# EAGLE schematic Cougar-eu_scheme_v36 (EAGLE 9.7.0)
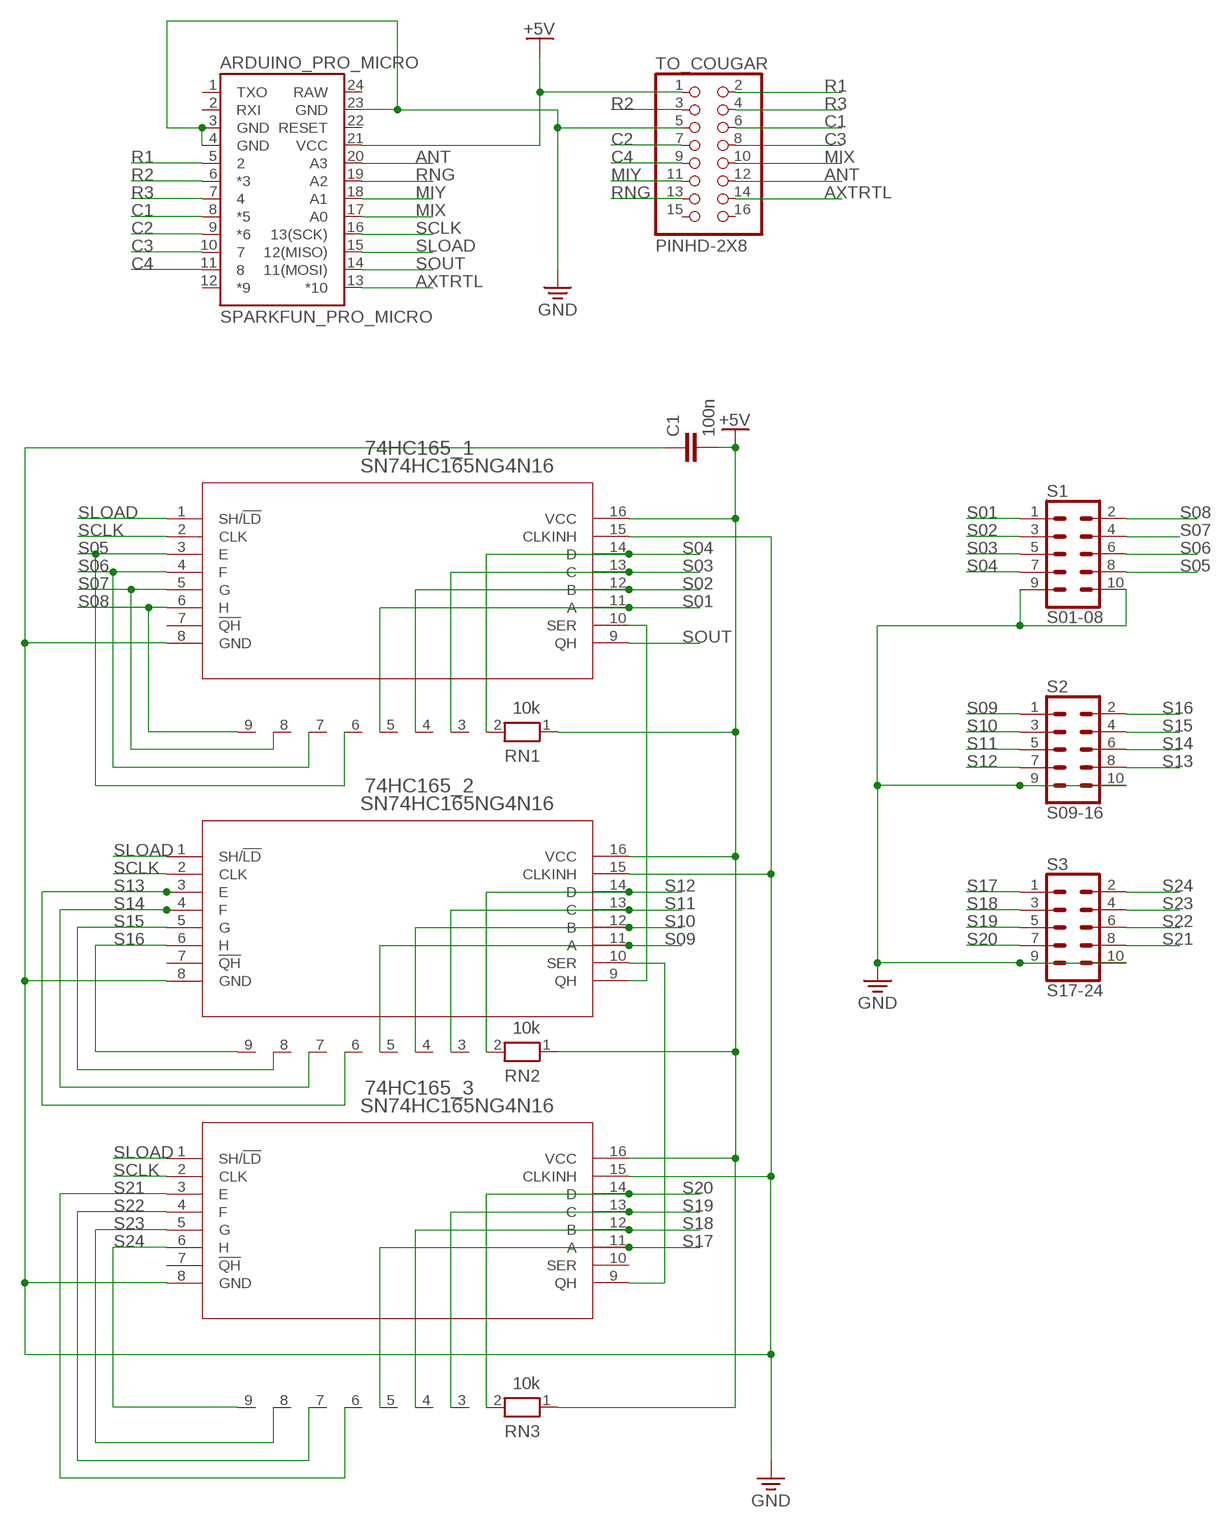
[diagram p0: schematic, sheet 1]

## Parts
74HC165_1  SN74HC165NG4N16  [N16]
74HC165_2  SN74HC165NG4N16  [N16]
74HC165_3  SN74HC165NG4N16  [N16]
ARDUINO_PRO_MICRO  SPARKFUN_PRO_MICRO  [SPARKFUN_PRO_MICRO]
C1  100n  C2,5-3  [C2.5-3]
RN1  10k  RN08  [RN-9]
RN2  10k  RN08  [RN-9]
RN3  10k  RN08  [RN-9]
S1  S01-08  CONN_05X2PTH  [2X5]
S2  S09-16  CONN_05X2PTH  [2X5]
S3  S17-24  CONN_05X2PTH  [2X5]
TO_COUGAR  PINHD-2X8  [2X08]

## Nets
+5V [Power]: 74HC165_1.16(VCC) 74HC165_2.16(VCC) 74HC165_3.16(VCC) ARDUINO_PRO_MICRO.21(VCC) C1.2 RN1.1 RN2.1 RN3.1 TO_COUGAR.1
ANT: ARDUINO_PRO_MICRO.20(A3) TO_COUGAR.12
AXTRTL: ARDUINO_PRO_MICRO.13(*10) TO_COUGAR.14
C1: ARDUINO_PRO_MICRO.8(*5) TO_COUGAR.6
C2: ARDUINO_PRO_MICRO.9(*6) TO_COUGAR.7
C3: ARDUINO_PRO_MICRO.10 TO_COUGAR.8
C4: ARDUINO_PRO_MICRO.11 TO_COUGAR.9
GND: 74HC165_1.8(GND) 74HC165_1.15(CLKINH) 74HC165_2.8(GND) 74HC165_2.15(CLKINH) 74HC165_3.8(GND) 74HC165_3.15(CLKINH) ARDUINO_PRO_MICRO.3(GND) ARDUINO_PRO_MICRO.4(GND) ARDUINO_PRO_MICRO.23(GND) C1.1 S1.9 S1.10 S2.9 S2.10 S3.9 S3.10 TO_COUGAR.5
MIX: ARDUINO_PRO_MICRO.17(A0) TO_COUGAR.10
MIY: ARDUINO_PRO_MICRO.18(A1) TO_COUGAR.11
N$1: 74HC165_1.10(SER) 74HC165_2.9(QH)
N$2: 74HC165_2.10(SER) 74HC165_3.9(QH)
R1: ARDUINO_PRO_MICRO.5 TO_COUGAR.2
R2: ARDUINO_PRO_MICRO.6(*3) TO_COUGAR.3
R3: ARDUINO_PRO_MICRO.7 TO_COUGAR.4
RNG: ARDUINO_PRO_MICRO.19(A2) TO_COUGAR.13
S01: 74HC165_1.11(A) RN1.5 S1.1
S02: 74HC165_1.12(B) RN1.4 S1.3
S03: 74HC165_1.13(C) RN1.3 S1.5
S04: 74HC165_1.14(D) RN1.2 S1.7
S05: 74HC165_1.3(E) RN1.6 S1.8
S06: 74HC165_1.4(F) RN1.7 S1.6
S07: 74HC165_1.5(G) RN1.8 S1.4
S08: 74HC165_1.6(H) RN1.9 S1.2
S09: 74HC165_2.11(A) RN2.5 S2.1
S10: 74HC165_2.12(B) RN2.4 S2.3
S11: 74HC165_2.13(C) RN2.3 S2.5
S12: 74HC165_2.14(D) RN2.2 S2.7
S13: 74HC165_2.3(E) RN2.6 S2.8
S14: 74HC165_2.4(F) RN2.7 S2.6
S15: 74HC165_2.5(G) RN2.8 S2.4
S16: 74HC165_2.6(H) RN2.9 S2.2
S17: 74HC165_3.11(A) RN3.5 S3.1
S18: 74HC165_3.12(B) RN3.4 S3.3
S19: 74HC165_3.13(C) RN3.3 S3.5
S20: 74HC165_3.14(D) RN3.2 S3.7
S21: 74HC165_3.3(E) RN3.6 S3.8
S22: 74HC165_3.4(F) RN3.7 S3.6
S23: 74HC165_3.5(G) RN3.8 S3.4
S24: 74HC165_3.6(H) RN3.9 S3.2
SCLK: 74HC165_1.2(CLK) 74HC165_2.2(CLK) 74HC165_3.2(CLK) ARDUINO_PRO_MICRO.16(13(SCK))
SLOAD: 74HC165_1.1(SH/!LD) 74HC165_2.1(SH/!LD) 74HC165_3.1(SH/!LD) ARDUINO_PRO_MICRO.15(12(MISO))
SOUT: 74HC165_1.9(QH) ARDUINO_PRO_MICRO.14(11(MOSI))
Unconnected: 74HC165_1.7(!QH) 74HC165_2.7(!QH) 74HC165_3.7(!QH) 74HC165_3.10(SER) ARDUINO_PRO_MICRO.1(TXO) ARDUINO_PRO_MICRO.2(RXI) ARDUINO_PRO_MICRO.12(*9) ARDUINO_PRO_MICRO.22(RESET) TO_COUGAR.15 TO_COUGAR.16

## Power pins joined to a net without a drawn wire
RAW: ARDUINO_PRO_MICRO.24(RAW)

## Library data of the parts
74HC165_1-74HC165_3 = 2022-07-30_21-57-33_Library:SN74HC165NG4; COPYRIGHT: Copyright (C) 2022 Ultra Librarian. All rights reserved.; MANUFACTURER_PART_NUMBER: SN74HC165NG4; MFR_NAME: Texas Instruments
ARDUINO_PRO_MICRO = SparkFun-Boards:SPARKFUN_PRO_MICRO: SparkFun Pro Micro Atmega32U4 compatible footprint. SparkFun Products: 3.3V/8MHz <https://www.sparkfun.com/products/12587> 5V/16MHz <https://www.sparkfun.com/products/12640>
C1 = capacitor-wima:C: CAPACITOR naming: grid - package width
RN1-RN3 = resistor-net:RN08: RESISTOR NETWORK; OC_FARNELL: unknown; OC_NEWARK: unknown
S1-S3 = SparkFun-Connectors:CONN_05X2: Multi connection point. Often used as Generic Header-pin footprint for 0.1 inch spaced/style header connections For AVR SPI programming port, see special device with nice symbol: "AVR_SPI_PROG_5x2.dev" You can populate with any combo of single row headers, but if you'd like an exact match, check these: 2x5 AVR ICSP Male Header <https://www.sparkfun.com/products/778> (PRT-00778) 2x5 Pin Shrouded Header <https://www.sparkfun.com/products/8506> (PRT-08506) On any of the 0.1 inch spaced packages, you can populate with these: Break Away Headers - Straight <https://www.sparkfun.com/products/116> (PRT-00116) Break Away Male Headers - Right Angle <https://www.sparkfun.com/products/553> (PRT-00553) Female Headers <https://www.sparkfun.com/products/115> (PRT-00115) Break Away Headers - Machine Pin <https://www.sparkfun.com/products/117> (PRT-00117) Break Away Female Headers - Swiss Machine Pin <https://www.sparkfun.com/products/743> (PRT-00743) Special note: the shrouded connector mates well with our 5x2 ribbon cables: 2x5 Pin IDC Ribbon Cable <https://www.sparkfun.com/products/8535> (PRT-08535); PROD_ID: CONN-08499; SF_ID: PRT-0778
TO_COUGAR = Connector:PINHD-2X8: PIN HEADER; CATEGORY: CONNECTOR; SUB-CATEGORY: PIN-HEADER

## Net classes
1 Power: width 0.4 mm